# EAGLE design bodenfeuchte (EAGLE 7.7.0)
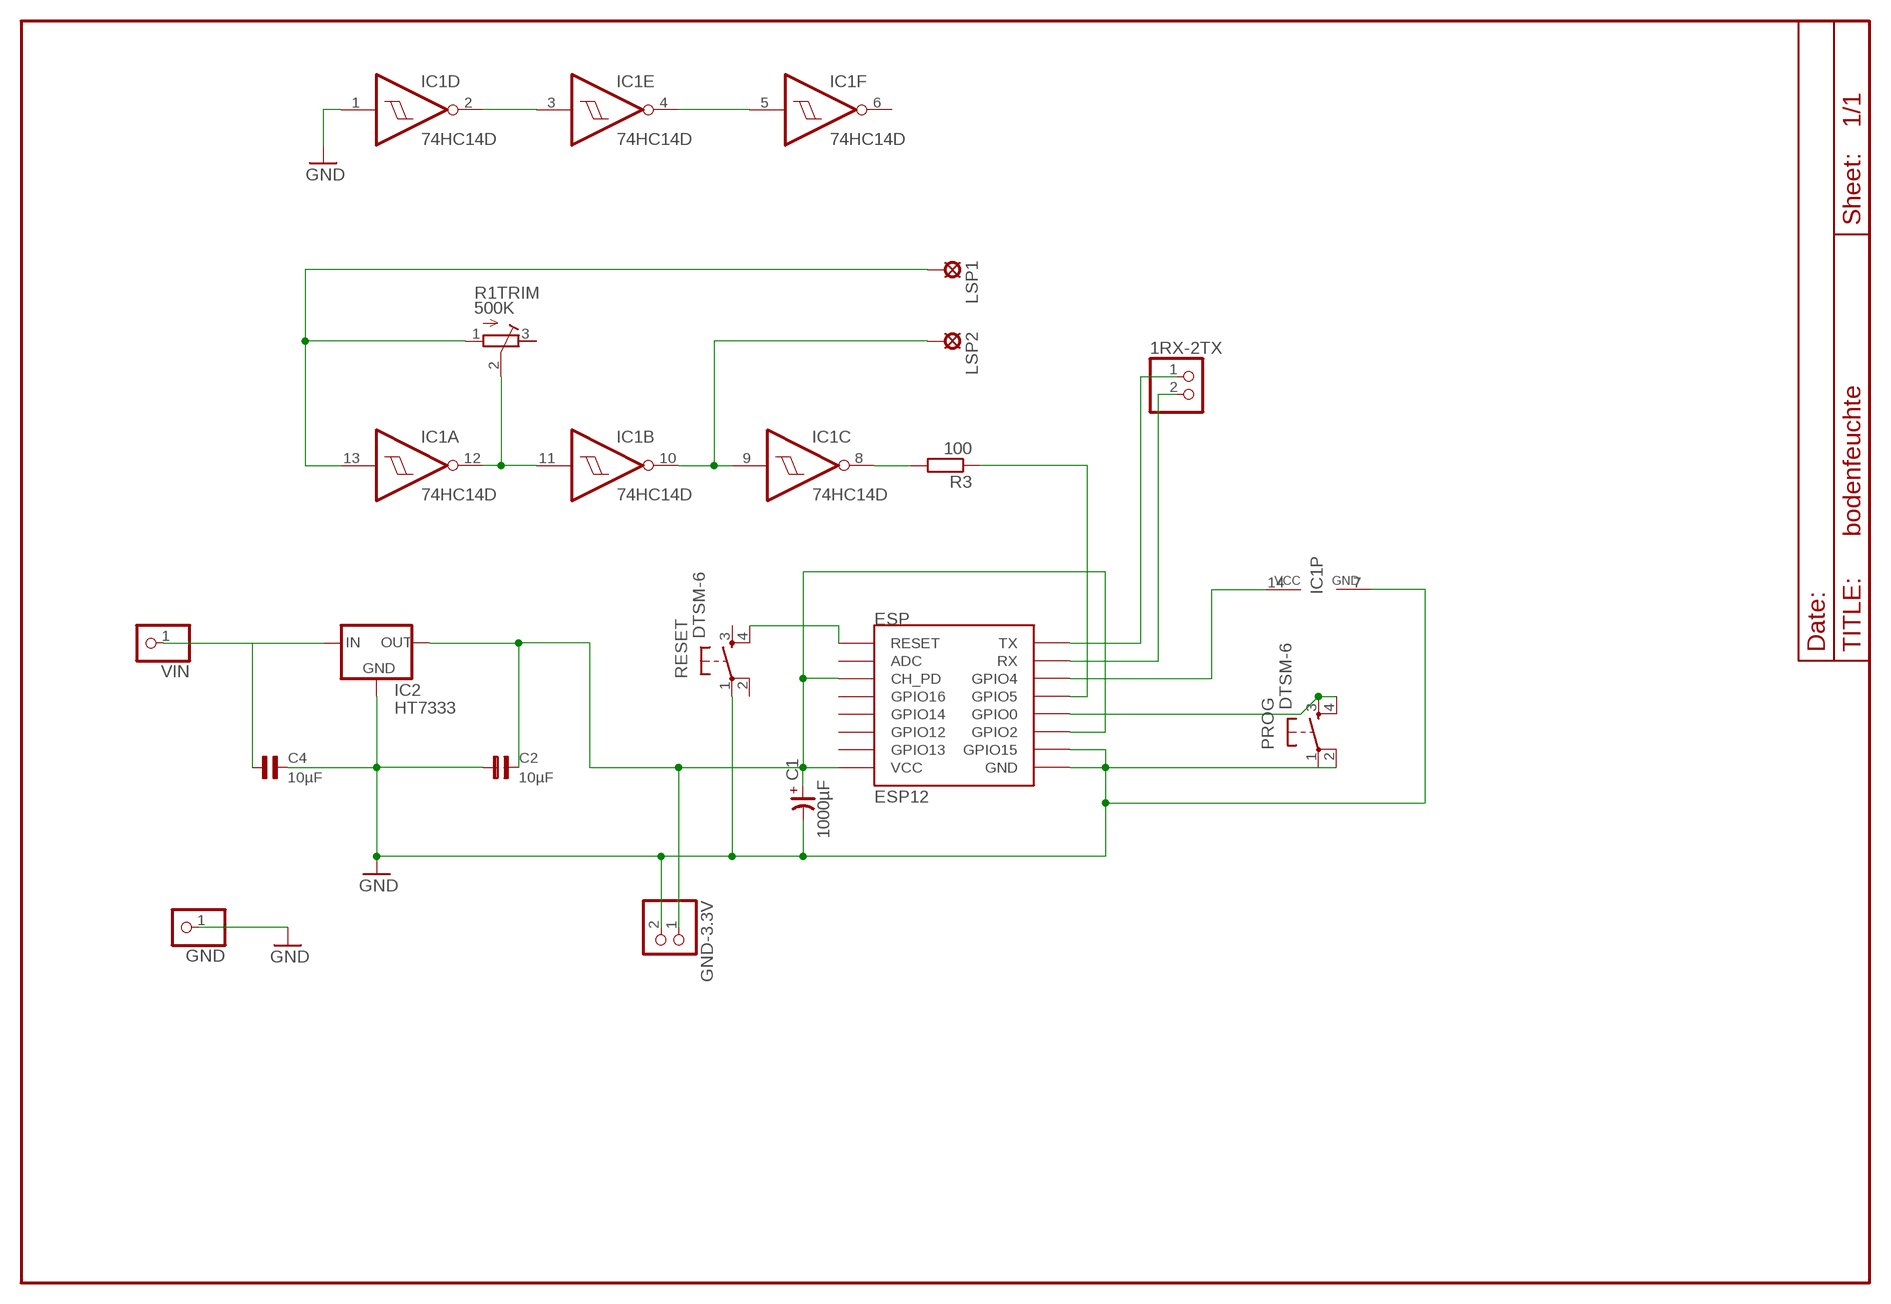
[diagram p0: schematic, sheet 1]

## Parts
1RX-2TX  PINHD-1X2  [1X02]
C1  1000µF  CP-SV-E/F  [SV-E/F]
C2  10µF  C1206  [1206]
C4  10µF  C1206  [1206]
ESP  ESP12  [ESP12]
GND  PINHD-1X1  [1X01]
GND-3.3V  PINHD-1X2  [1X02]
IC1  74HC14D  [SO14]
IC2  HT7333  [SOT-89]
LSP1  LSP11  [LSP11]
LSP2  LSP11  [LSP11]
PROG  DTSM-6  [DTSM-6]
R1TRIM  500K  R-TRIMM3374  [RTRIM3374]
R3  100  R-EU_R0603  [R0603]
RESET  DTSM-6  [DTSM-6]
VIN  PINHD-1X1  [1X01]

## Nets
3.3V: C1.+ C2.2 ESP.CH_PD ESP.GPIO2 ESP.VCC GND-3.3V.1 IC2.1(OUT)
BIS6VVCC: C4.1 IC2.3(IN) IC2.4(IN) VIN.1
GND: C1.- C2.1 C4.2 ESP.GND ESP.GPIO15 GND-3.3V.2 GND.1 IC1.1(D:I) IC1.7(P:GND) IC2.2(GND) PROG.1 PROG.2 RESET.1
N$1: 1RX-2TX.1 ESP.TX
N$2: 1RX-2TX.2 ESP.RX
N$3: ESP.GPIO4 IC1.14(P:VCC)
N$4: ESP.RESET RESET.4
N$5: IC1.2(D:O) IC1.3(E:I)
N$6: IC1.4(E:O) IC1.5(F:I)
N$7: IC1.9(C:I) IC1.10(B:O) LSP2.MP
N$8: IC1.11(B:I) IC1.12(A:O) R1TRIM.2(S)
N$9: ESP.GPIO0 IC1.13(A:I) LSP1.MP PROG.3 PROG.4 R1TRIM.1(A)
N$10: IC1.8(C:O) R3.2
N$11: ESP.GPIO5 R3.1
Unconnected: ESP.ADC ESP.GPIO12 ESP.GPIO13 ESP.GPIO14 ESP.GPIO16 IC1.6(F:O) R1TRIM.3(E) RESET.2 RESET.3

## Library data of the parts
1RX-2TX GND-3.3V = pinhead:PINHD-1X2: PIN HEADER
C1 = cap-master:CP-: POLARIZED CAP
C2 C4 = capsmd:C1206
ESP = esp8266modules:ESP12: ESP8266 Wifi module 12
GND VIN = pinhead:PINHD-1X1: PIN HEADER
IC1 = 74xx-eu:74*14: Hex schmitt trigger INVERTER
IC2 = holtek2:HT73*
LSP1 LSP2 = solpad:LSP11: SOLDER PAD drill 1.1 mm
PROG RESET = switch-tact:DTSM-6
R1TRIM = rcl:R-TRIMM: Trimm resistor
R3 = rcl:R-EU_: RESISTOR, European symbol

## Net classes
0 default: width 0.508 mm, clearance 0.305 mm

## Board
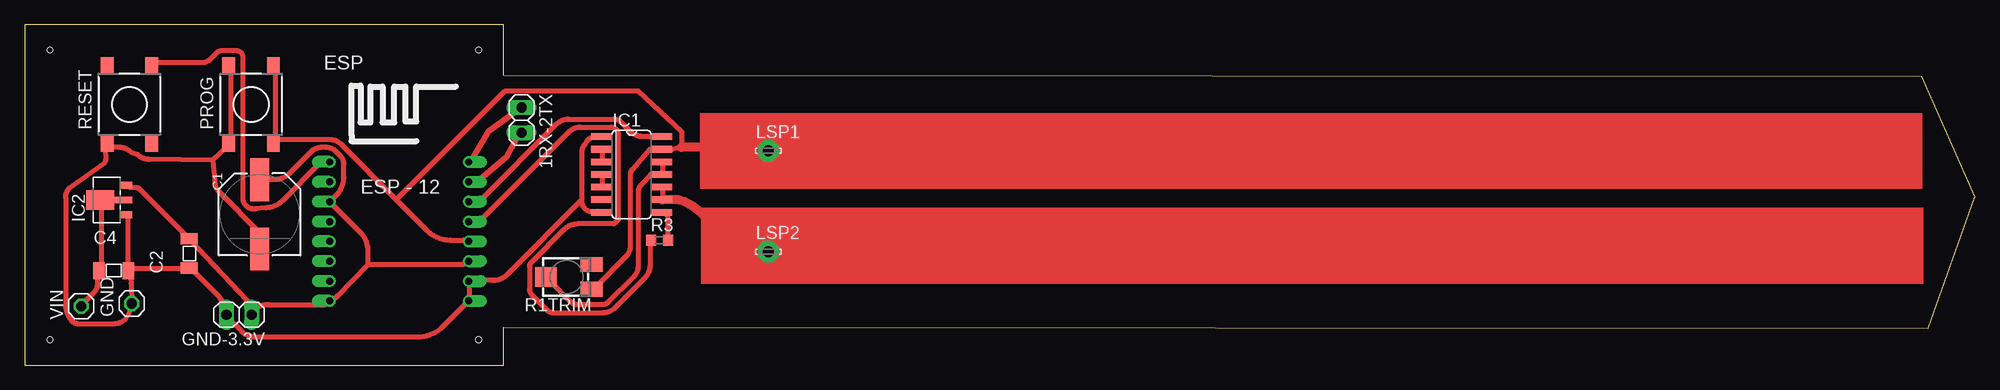
[diagram p1: board, top side]
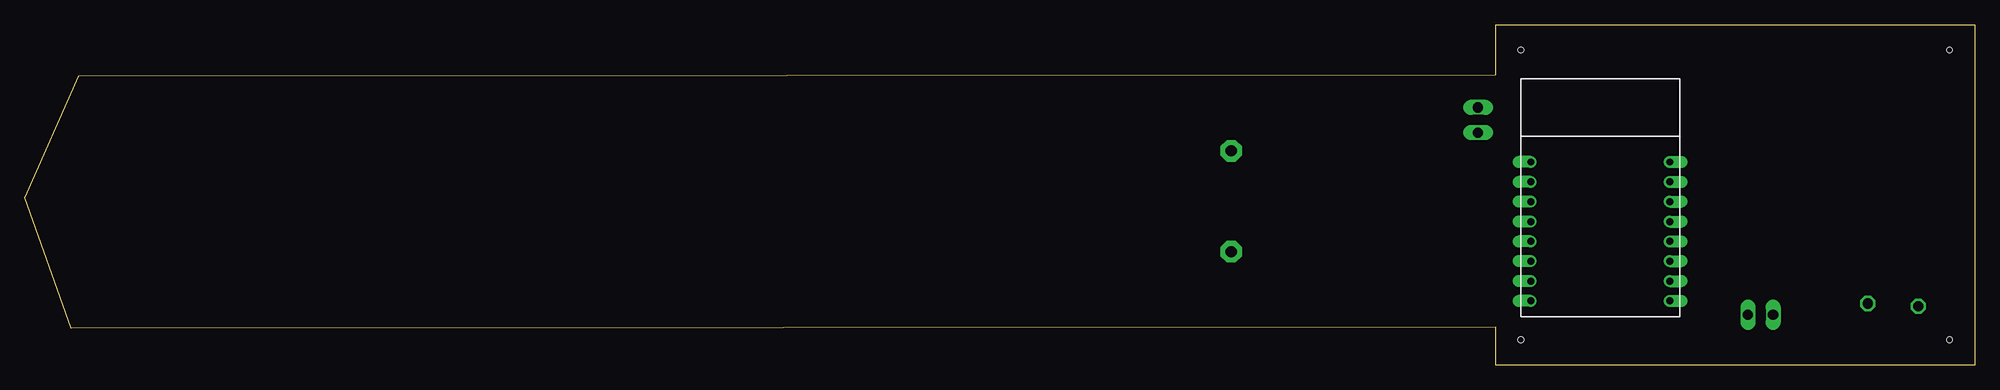
[diagram p2: board, bottom side, seen from below]

Size 196.51 x 34.29 mm. Coordinates in mm from the lower left corner, seen from the top.
Outline: 48.26,29.21 191.15,29.11 196.51,16.91 191.85,3.71 48.26,3.81 48.26,0 0,0 0,34.29 48.26,34.29 48.26,29.21
Copper layers (1*16): Top 0.035mm / dielectric 1.5mm / Bottom 0.035mm
Design rules "default *": minimum track width 12mil, minimum drill 24mil, track to track 8mil, track to pad 8mil, pad to pad 8mil, via to via 8mil, smd to smd 8mil, copper to edge 40mil, drill to drill 8mil, minimum pad ring 10mil, minimum via ring 8mil, stop-mask expansion 4mil, vias tented up to drill 0mil, thermal gap 10mil
Holes 0.6 mm at 2.54,2.54 45.72,2.54 45.72,31.75 2.54,31.75

### Footprints (pad centres in the part's own frame; a part is rotated, then mirrored left to right if it is on the bottom)
1X02 = drill 1.016 long: 1 -1.27,0; 2 1.27,0
SV-E/F = smd 4.318 x 1.93: + -3.493,0; - 3.493,0
1206 = smd 1.143 x 1.702: 1 -1.473,0; 2 1.473,0
ESP12 = drill 0.7 offset: ADC -7.1,3.8; CH_PD -7.1,1.8; GND 6.9,-8.2; GPIO0 6.9,-2.2; GPIO2 6.9,-4.2; GPIO4 6.9,1.8; GPIO5 6.9,-0.2; GPIO12 -7.1,-4.2; GPIO13 -7.1,-6.2; GPIO14 -7.1,-2.2; GPIO15 6.9,-6.2; GPIO16 -7.1,-0.2; RESET -7.1,5.8; RX 6.9,3.8; TX 6.9,5.8; VCC -7.1,-8.2
1X01 = drill 1.016 octagon: 1 0,0
SO14 = smd 0.66 x 2.032: 1 -3.81,-3.073; 2 -2.54,-3.073; 3 -1.27,-3.073; 4 0,-3.073; 5 1.27,-3.073; 6 2.54,-3.073; 7 3.81,-3.073; 8 3.81,3.073; 9 2.54,3.073; 10 1.27,3.073; 11 0,3.073; 12 -1.27,3.073; 13 -2.54,3.073; 14 -3.81,3.073
SOT-89 = smd 0.7 x 1.1: 1 1.5,-2.385; 2 -1.5,-2.385 | smd 0.7 x 1.8: 3 0,-2.035 | smd 2 x 2.8: 4 0,0.265
LSP11 = drill 1.118 pad 2.159 octagon: MP 0,0
DTSM-6 = smd 1.55 x 1.3: 1 -3.975,2.25; 2 3.975,2.25; 3 -3.975,-2.25; 4 3.975,-2.25
RTRIM3374 = smd 1.5 x 2.2: 1 -1.25,-2.5; 3 1.25,-2.5 | smd 1.98 x 2.17: 2 0,2.1
R0603 = smd 1 x 1.1: 1 -0.85,0; 2 0.85,0

### Placement (x,y rotation side)
1RX-2TX  50.06,24.69 270 top
C1  23.67,15.19 270 top
C2  16.58,11.26 90 top
C4  8.96,9.53 0 top
ESP  37.84,14.67 0 top
GND  10.77,6.21 90 top
GND-3.3V  21.59,5.08 180 top
IC1  61.15,19.21 270 top
IC2  7.88,16.64 90 top
LSP1  74.93,21.59 0 top
LSP2  74.93,11.43 0 top
PROG  22.81,26.27 90 top
R1TRIM  54.61,8.89 90 top
R3  63.96,12.59 0 top
RESET  10.54,26.27 90 top
VIN  5.69,5.94 90 top

### Tracks (layer width: path | path; a pad name or v marks a point on that pad's centre or on a via)
3.3V
  Top 0.508: IC2.1 10.62,17.88 11.28,17.88 arc-45 11.54,17.78 16.31,13.01 C2.2 16.71,12.6 23.22,5.69 | 23.22,5.69 arc-45 24.6,6.1 30.1,6.1 arc61 ESP.VCC arc36 31.48,6.94 34.6,10.16 | 23.22,5.69 23.21,5.37 arc-15 23.1,5.22 GND-3.3V.1 | 34.6,10.16 44.02,10.16 arc38 44.6,10.36 ESP.GPIO2 | 34.6,10.16 34.6,11.47 arc45 33.8,13.4 30.94,16.26 ESP.CH_PD 30.93,16.66 arc1 30.94,16.67 31.35,17.07 arc45 32.16,19.02 32.16,20.22 arc45 31.8,21.09 31.35,21.53 arc45 30.36,21.95 29.92,21.95 arc45 28.88,21.52 26.71,19.35 arc-45 25.14,18.69 24.03,18.69 C1.+
BIS6VVCC
  Top 0.508: IC2.3 9.8,16.66 7.77,16.66 IC2.4 7.77,16.26 7.77,9.75 C4.1 7.37,9.35 7.37,8.25 arc-45 6.99,7.35 5.74,6.1 VIN.1
GND
  Top 0.508: 18.95,20.63 12.56,20.73 arc-45 11.32,21.24 10.7,21.46 arc45 9.53,21.95 8.59,21.95 RESET.1 8.18,21.95 8.18,21.24 arc-45 8.02,20.37 4.51,17.86 arc45 4.12,16.91 4.12,6.08 arc45 4.78,4.42 arc45 5.38,4.17 8.75,4.17 arc45 10.16,4.64 10.66,5.54 arc-8 10.68,6.15 GND.1 10.72,8.2 10.62,9.35 C4.2 | 18.95,20.63 20.37,21.95 PROG.1 20.78,22.35 20.78,30.07 PROG.2 | 18.95,20.63 19.15,18.55 arc45 19.63,17.41 23.62,13.41 23.62,11.79 C1.- | IC2.2 10.41,15.04 10.41,9.75 C4.2 | C4.2 10.62,9.75 16.31,9.75 C2.1 16.71,9.75 19.52,6.95 arc-45 19.96,5.87 19.96,5.69 arc60 GND-3.3V.2 arc31 20.52,4.73 21.85,3.39 arc45 23.18,2.85 39.58,2.85 arc45 42.17,3.92 44.32,6.07 arc-1 44.37,6.12 ESP.GND 44.76,6.5 44.76,8.13 ESP.GPIO15 arc-77 44.82,8.53 47.19,8.53 arc45 48.59,9.11 56.13,16.66 | 56.13,16.66 56.13,16.52 arc90 57.21,15.44 arc90 57.47,15.4 | 57.77,15.5 57.47,15.4 | 57.47,15.4 57.46,15.34 IC1.7 | 56.13,16.66 56.13,21.48 arc-45 56.47,22.28 56.64,22.55 arc-45 57.25,22.96 57.76,23.06 IC1.1
N$1
  Top 0.6: ESP.TX 45.04,20.64 46.77,23.6 1RX-2TX.1
N$2
  Top 0.6: ESP.RX 45.61,18.47 48.57,21 49.56,22.79 1RX-2TX.2
N$3
  Top 0.508: ESP.GPIO4 arc-86 44.95,16.66 45.97,16.66 53.61,24.3 arc-45 54.8,24.79 59.36,24.79 arc-45 60.1,24.48 60.87,23.71 arc45 62.09,23.07 63.76,23.07 IC1.14
N$4
  Top 0.508: RESET.4 13.06,30.48 17.9,30.48 arc45 18.65,30.79 19.32,31.46 arc-45 19.89,31.7 21.24,31.7 arc-90 22,30.95 22,16.64 arc90 23.28,15.75 24.28,15.85 arc45 25.93,16.53 29.72,20.32 30.53,20.32 ESP.RESET
N$5
  Top 0.508: IC1.3 58.17,20.73 58.17,21.54 IC1.2
N$6
  Top 0.508: IC1.5 58.17,17.88 58.17,19.1 IC1.4
N$7
  Top 0.508: IC1.10 64.26,17.88 64.26,16.66 IC1.9 | 74.83,11.79 LSP2.MP
  Top 0.9: 74.83,11.79 69.5,13.51 arc45 65.96,16.66 64.26,16.66
N$8
  Top 0.508: IC1.12 64.26,20.32 64.26,19.51 IC1.11 63.86,19.2 63.04,19.2 62.1,18.16 arc45 61.82,17.49 61.82,10.08 arc-45 61.3,8.83 58.81,6.33 arc-45 58.24,6.1 55.75,6.1 arc-45 55.02,6.4 52.88,8.53 R1TRIM.2
N$9
  Top 0.508: 74.83,21.95 LSP1.MP | R1TRIM.1 57.35,7.72 60.65,11.01 arc45 61.01,11.9 61.01,19.19 arc-45 61.23,19.73 62.94,21.74 63.76,21.74 IC1.13 65.26,21.75 66.19,21.95 66.19,23.57 61.82,27.64 48.41,27.64 37.44,16.66 | 25.25,22.76 25.25,30.07 PROG.4 | 25.25,22.76 25.25,22.35 PROG.3 25.25,22.76 | 37.44,16.66 40.52,13.58 arc45 42.89,12.6 44.18,12.6 arc-18 44.51,12.54 ESP.GPIO0 | 25.25,22.76 30.68,22.76 arc-45 31.81,22.29 37.44,16.66
  Top 0.9: 74.83,21.95 66.19,21.95
N$10
  Top 0.508: R3.2 64.77,12.6 64.77,15.04 64.26,15.44 IC1.8
N$11
  Top 0.508: ESP.GPIO5 arc-85 44.92,14.63 45.97,14.63 54.85,23.5 arc-45 55.99,23.98 59.05,23.98 arc-45 59.62,23.74 arc-45 59.79,23.33 59.79,14.69 arc-45 59.75,14.59 59.39,14.22 55.69,14.22 arc45 54.37,13.68 51.01,10.32 arc45 50.85,9.94 50.85,7.72 arc45 51.14,7.03 52.62,5.55 arc45 53.26,5.28 58.27,5.28 arc45 59.48,5.79 62.51,8.82 arc45 63.04,10.1 63.04,12.19 R3.1
(copper drawn outside any net)
  shapes: Top area x2